# EAGLE design attinys2 (EAGLE 9.3.0)
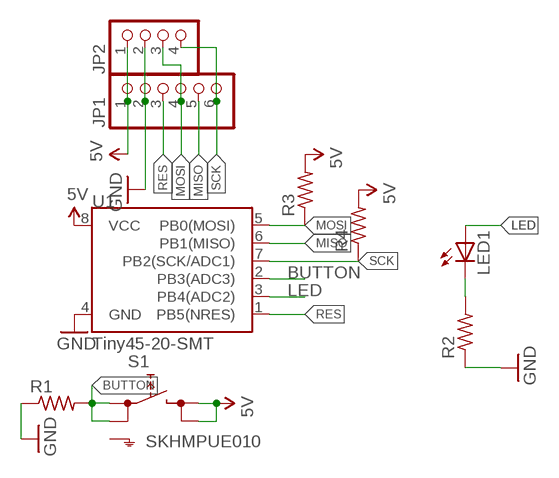
[diagram p0: schematic, sheet 1]

## Parts
JP1  PINHD-1X6  [1X06]
JP2  PINHD-1X4  [1X04]
LED1  LEDSML1206  [SML1206]
R1  R-US_R1206  [R1206]
R2  R-US_R1206  [R1206]
R3  R-US_R1206  [R1206]
R4  R-US_R1206  [R1206]
S1  SKHMPUE010  [SKHMPXE010]
U1  Tiny45-20-SMT  ATTINY45TINY45-20-SMT  [SO08-EIAJ]

## Nets
5V: JP1.1 JP2.1 R3.2 R4.2 S1.3(2.1) S1.4(2.2) U1.8(VCC)
BUTTON: R1.2 S1.1(1.1) S1.2(1.2) U1.2(PB3(ADC3))
GND: JP1.2 JP2.2 R1.1 R2.1 U1.4(GND)
LED: LED1.A U1.3(PB4(ADC2))
MISO: JP1.5 U1.6(PB1(MISO))
MOSI: JP1.4 JP2.3 R3.1 U1.5(PB0(MOSI))
N$1: LED1.C R2.2
RES: JP1.3 U1.1(PB5(NRES))
SCK: JP1.6 JP2.4 R4.1 U1.7(PB2(SCK/ADC1))
Unconnected: S1.5(SH)

## Library data of the parts
JP1 = pinhead:PINHD-1X6: PIN HEADER
JP2 = pinhead:PINHD-1X4: PIN HEADER
LED1 = led:LED: LED OSRAM: - CHIPLED LG R971, LG N971, LY N971, LG Q971, LY Q971, LO R971, LY R971 LH N974, LH R974 LS Q976, LO Q976, LY Q976 LO Q996 - Hyper CHIPLED LW Q18S LB Q993, LB Q99A, LB R99A - SideLED LS A670, LO A670, LY A670, LG A670, LP A670 LB A673, LV A673, LT A673, LW A673 LH A674 LY A675 LS A676, LA A676, LO A676, LY A676, LW A676 LS A679, LY A679, LG A679 - Hyper Micro SIDELED® LS Y876, LA Y876, LO Y876, LY Y876 LT Y87S - SmartLED LW L88C, LW L88S LB L89C, LB L89S, LG L890 LS L89K, LO L89K, LY L89K LS L896, LA L896, LO L896, LY L896 - TOPLED LS T670, LO T670, LY T670, LG T670, LP T670 LSG T670, LSP T670, LSY T670, LOP T670, LYG T670 LG T671, LOG T671, LSG T671 LB T673, LV T673, LT T673, LW T673 LH T674 LS T676, LA T676, LO T676, LY T676, LB T676, LH T676, LSB T676, LW T676 LB T67C, LV T67C, LT T67C, LS T67K, LO T67K, LY T67K, LW E67C LS E67B, LA E67B, LO E67B, LY E67B, LB E67C, LV E67C, LT E67C LW T67C LS T679, LY T679, LG T679 LS T770, LO T770, LY T770, LG T770, LP T770 LB T773, LV T773, LT T773, LW T773 LH T774 LS E675, LA E675, LY E675, LS T675 LS T776, LA T776, LO T776, LY T776, LB T776 LHGB T686 LT T68C, LB T68C - Hyper Mini TOPLED® LB M676 - Mini TOPLED Santana® LG M470 LS M47K, LO M47K, LY M47K Source: http://www.osram.convergy.de LUXEON: - LUMILED® LXK2-PW12-R00, LXK2-PW12-S00, LXK2-PW14-U00, LXK2-PW14-V00 LXK2-PM12-R00, LXK2-PM12-S00, LXK2-PM14-U00 LXK2-PE12-Q00, LXK2-PE12-R00, LXK2-PE12-S00, LXK2-PE14-T00, LXK2-PE14-U00 LXK2-PB12-K00, LXK2-PB12-L00, LXK2-PB12-M00, LXK2-PB14-N00, LXK2-PB14-P00, LXK2-PB14-Q00 LXK2-PR12-L00, LXK2-PR12-M00, LXK2-PR14-Q00, LXK2-PR14-R00 LXK2-PD12-Q00, LXK2-PD12-R00, LXK2-PD12-S00 LXK2-PH12-R00, LXK2-PH12-S00 LXK2-PL12-P00, LXK2-PL12-Q00, LXK2-PL12-R00 Source: www.luxeon.com KINGBRIGHT: KA-3528ASYC Source: www.kingbright.com
R1-R4 = resistor:R-US_: RESISTOR, American symbol
S1 = switch:SKHMP*E010: 6.2 X 6.5mm TACT Switch (SMD) Source: http://www3.alps.co.jp/WebObjects/catalog.woa/PDF/E/Switch/Tact/SKHM/SKHM.PDF
U1 = SparkFun-DigitalIC:ATTINY45: Atmel 8-pin 2/4/8kB flash uC; PROD_ID: IC-08922

## Board
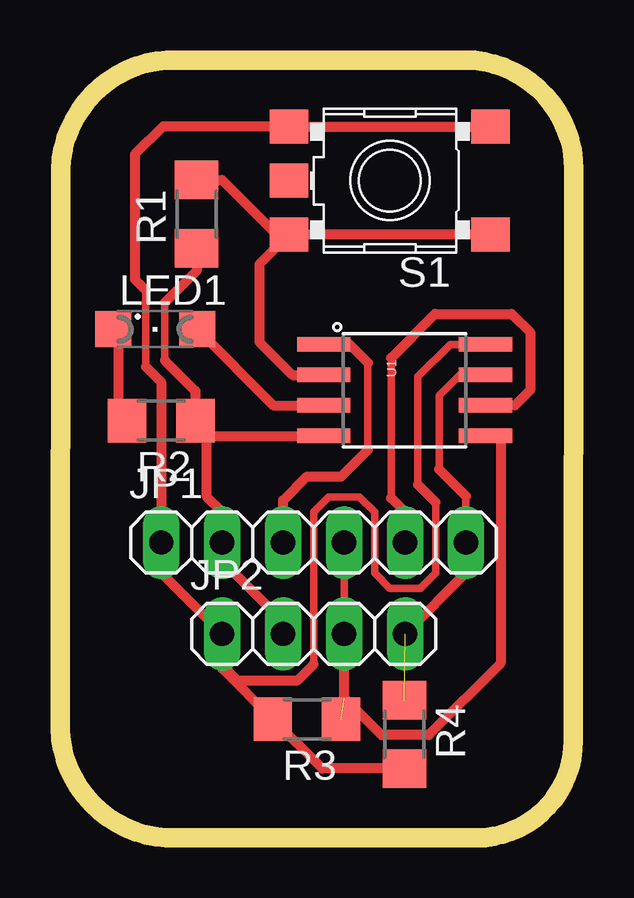
[diagram p1: board, top side]

Size 21.41 x 32.44 mm. Coordinates in mm from the lower left corner, seen from the top.
Outline: 0.03,27.86 arc-90 4.9,32.44 16.84,32.44 arc-90 21.41,27.86 21.39,4.06 arc-90 17.32,0 4.88,0 arc-90 0,4.57 0.03,27.86
Copper layers (1*16): Top 0.035mm / dielectric 1.5mm / Bottom 0.035mm
Design rules "default *": minimum track width 12mil, minimum drill 24mil, track to track 8mil, track to pad 8mil, pad to pad 8mil, via to via 8mil, smd to smd 8mil, copper to edge 40mil, drill to drill 8mil, minimum pad ring 10mil, minimum via ring 8mil, stop-mask expansion 4mil, vias tented up to drill 0mil, thermal gap 10mil

### Footprints (pad centres in the part's own frame; a part is rotated, then mirrored left to right if it is on the bottom)
1X06 = drill 1.016 long: 1 -6.35,0; 2 -3.81,0; 3 -1.27,0; 4 1.27,0; 5 3.81,0; 6 6.35,0
1X04 = drill 1.016 long: 1 -3.81,0; 2 -1.27,0; 3 1.27,0; 4 3.81,0
SML1206 = smd 1.5 x 1.5: A 1.75,0; C -1.75,0
R1206 = smd 1.6 x 1.803: 1 -1.422,0; 2 1.422,0
SKHMPXE010 = smd 1.6 x 1.4: 1 -4.2,2.25; 2 4.2,2.25; 3 -4.2,-2.25; 4 4.2,-2.25; 5 4.2,0
SO08-EIAJ = smd 0.61 x 2.21: 1 -1.905,-3.378; 2 -0.635,-3.378; 3 0.635,-3.378; 4 1.905,-3.378; 5 1.905,3.353; 6 0.635,3.353; 7 -0.635,3.353; 8 -1.905,3.353

### Placement (x,y rotation side)
JP1  10.57,12.32 0 top
JP2  10.57,8.51 0 top
LED1  3.96,21.21 0 top
R1  5.69,26.01 90 top
R2  4.22,17.4 180 top
R3  10.29,4.95 180 top
R4  14.35,4.32 270 top
S1  13.74,27.41 180 top
U1  14.38,18.67 270 top

### Tracks (layer width: path | path; a pad name or v marks a point on that pad's centre or on a via)
5V
  Top 0.305: 9.93,29.95 S1.4 9.3,29.95 | 17.55,29.95 S1.3 | U1.8 16.26,20.57 14.91,19.23 14.91,14.73 | 15.65,14 15.65,11.05 15.01,10.41 13.74,10.41 13.11,11.05 13.11,13.59 12.47,14.22 11.2,14.22 10.57,13.59 10.57,7.24 | JP2.1 6.76,7.21 | 3.58,22.83 3.58,19.65
  Top 0.406: 15.65,14 14.91,14.73 | 10.57,7.24 9.91,6.58 7.39,6.58 6.76,7.21 | 3.58,19.65 4.22,19.02 JP1.1 4.22,11.05 JP2.1 6.76,7.06 R3.2 10.92,2.9 R4.2 | 3.58,22.83 3.12,23.29 3.12,28.5 4.28,29.66 S1.4 S1.3
BUTTON
  Top 0.305: 9.3,25.5 S1.2 | 17.55,25.5 S1.1 | 9.93,25.5 S1.2 | 9.03,25.16 S1.2
  Top 0.406: U1.2 9.68,19.3 8.31,20.68 8.31,23.92 S1.2 S1.1 | R1.2 6.76,27.43 9.03,25.16
GND
  Top 0.305: 4.37,22.33 4.37,19.91 | 6.12,16.76 6.12,17.4 R2.1 6.12,16.76
  Top 0.406: U1.4 6.12,16.76 6.12,14.22 6.76,13.59 JP1.2 6.76,11.56 9.3,9.02 JP2.2 | R1.1 5.69,23.65 4.37,22.33 | 4.37,19.91 5.64,18.64 R2.1
LED
  Top 0.406: LED1.A 8.89,18.03 U1.3
MISO
  Top 0.305: 18.95,18.03 U1.6 | 13.79,14.17 13.79,20.01
  Top 0.406: 18.95,18.03 19.58,18.67 19.58,21.08 18.82,21.84 15.62,21.84 13.79,20.01 | JP1.5 14.38,13.59 13.79,14.17
MOSI  (1 unrouted)
  Top 0.305: 18.36,16.76 U1.5 | JP2.3 JP1.4
  Top 0.406: 18.36,16.76 18.36,7.29 15.37,4.29 13.39,4.29 11.84,5.84 JP2.3
N$1
  Top 0.305: 2.44,21.21 LED1.C | 2.44,17.4 R2.2
  Top 0.406: 2.44,17.4 2.44,21.21
RES
  Top 0.305: 12.07,20.57 U1.1 | 12.83,16.18 12.83,19.81
  Top 0.406: 12.83,19.81 12.07,20.57 | 12.83,16.18 11.71,15.06 10.29,15.06 9.3,14.07 JP1.3
SCK  (1 unrouted)
  Top 0.305: 16.92,19.3 U1.7 16.66,19.3 15.8,18.44 15.8,15.37 | 16.92,14.25 JP1.6 16.92,11.05
  Top 0.406: 15.8,15.37 16.92,14.25 | 16.92,11.05 JP2.4